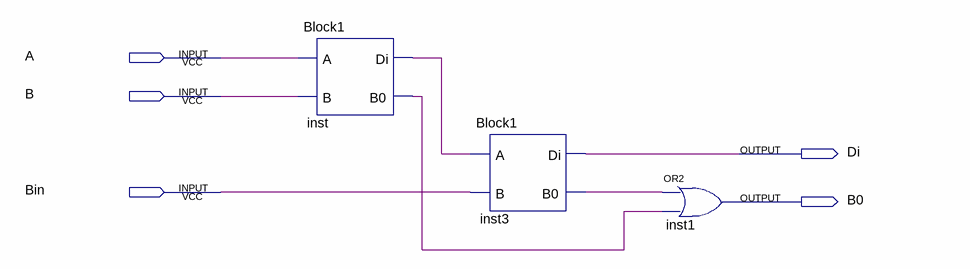
[diagram p0: schematic sheet]
// Quartus schematic Block2.bdf as structural Verilog: 3 symbols, 5 pins
module Block2 (
  input  A,
  input  B,
  input  Bin,
  output Di,
  output B0
);

  wire inst3_b0, inst_b0, inst_di;

  Block1 inst (.A(A), .B(B), .Di(inst_di), .B0(inst_b0));
  Block1 inst3 (.A(inst_di), .B(Bin), .Di(Di), .B0(inst3_b0));
  or inst1 (B0, inst3_b0, inst_b0);
endmodule
